# Altium schematic sheet QRE1113-4.SchDoc
size A
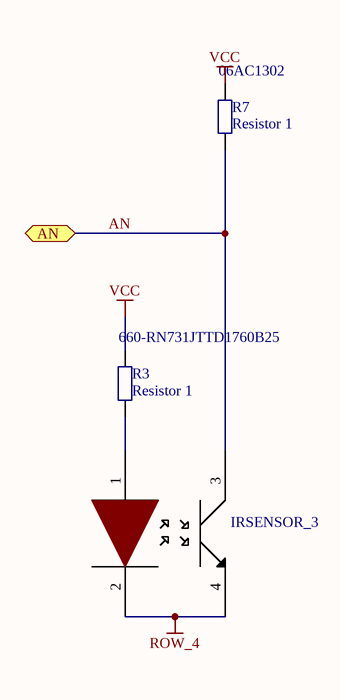
[diagram p0: QRE1113-4.SchDoc]

## Parts
IRSENSOR_3  QRE1113GR  [QRE1113GR]  (value not drawn)
R3  Resistor 1  Supplier Part Number 1: 660-RN731JTTD1760B25  [R-0603]
R7  Resistor 1  Supplier Part Number 1: 06AC1302  [R-0603]

## Ports
AN

## Nets
ROW_4: IRSENSOR_3.2 IRSENSOR_3.4
VCC: R3.2 R7.1
AN: IRSENSOR_3.3 R7.2 ; port AN
NetIRSENSOR_3_1: IRSENSOR_3.1 R3.1

## Library data of the parts
R3 R7 = Resistor 1: Resistor; Value: 1K
  R3: Supplier 1: Mouser
  R7: Supplier 1: Newark